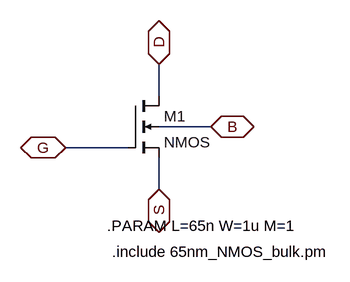
[diagram p0: schematic nmos65.asc]
nmos65.asc, the LTspice schematic file:
Version 4
SHEET 1 880 680
WIRE 160 144 160 96
WIRE 240 192 160 192
WIRE 112 224 16 224
WIRE 160 288 160 240
FLAG 16 224 G
IOPIN 16 224 BiDir
FLAG 160 96 D
IOPIN 160 96 BiDir
FLAG 160 288 S
IOPIN 160 288 BiDir
FLAG 240 192 B
IOPIN 240 192 BiDir
SYMBOL nmos4 112 144 R0
SYMATTR InstName M1
SYMATTR Value2 l={L} w={W} ad='2*65n*{W}' as='2*65n*{W}' pd='2*(2*65n+{W})' ps='2*(2*65n+{W})' m={M}
TEXT 80 344 Left 2 !.PARAM L=65n W=1u M=1
TEXT 88 384 Left 2 !.include 65nm_NMOS_bulk.pm

The netlist it stands for:
* nmos65.asc
M1 D G S B NMOS l={L} w={W} ad='2*65n*{W}' as='2*65n*{W}' pd='2*(2*65n+{W})' ps='2*(2*65n+{W})' m={M}
.model NMOS NMOS
.model PMOS PMOS
.lib standard.mos
.PARAM L=65n W=1u M=1
.include 65nm_NMOS_bulk.pm
.backanno
.end